# Altium schematic sheet XS1_XCORE0.SchDoc: XS1 CORE0
size A3; Date: 2011-11-28; Author: S.Choquette; Revision: 2.0; SheetNumber: 3; SheetTotal: 9
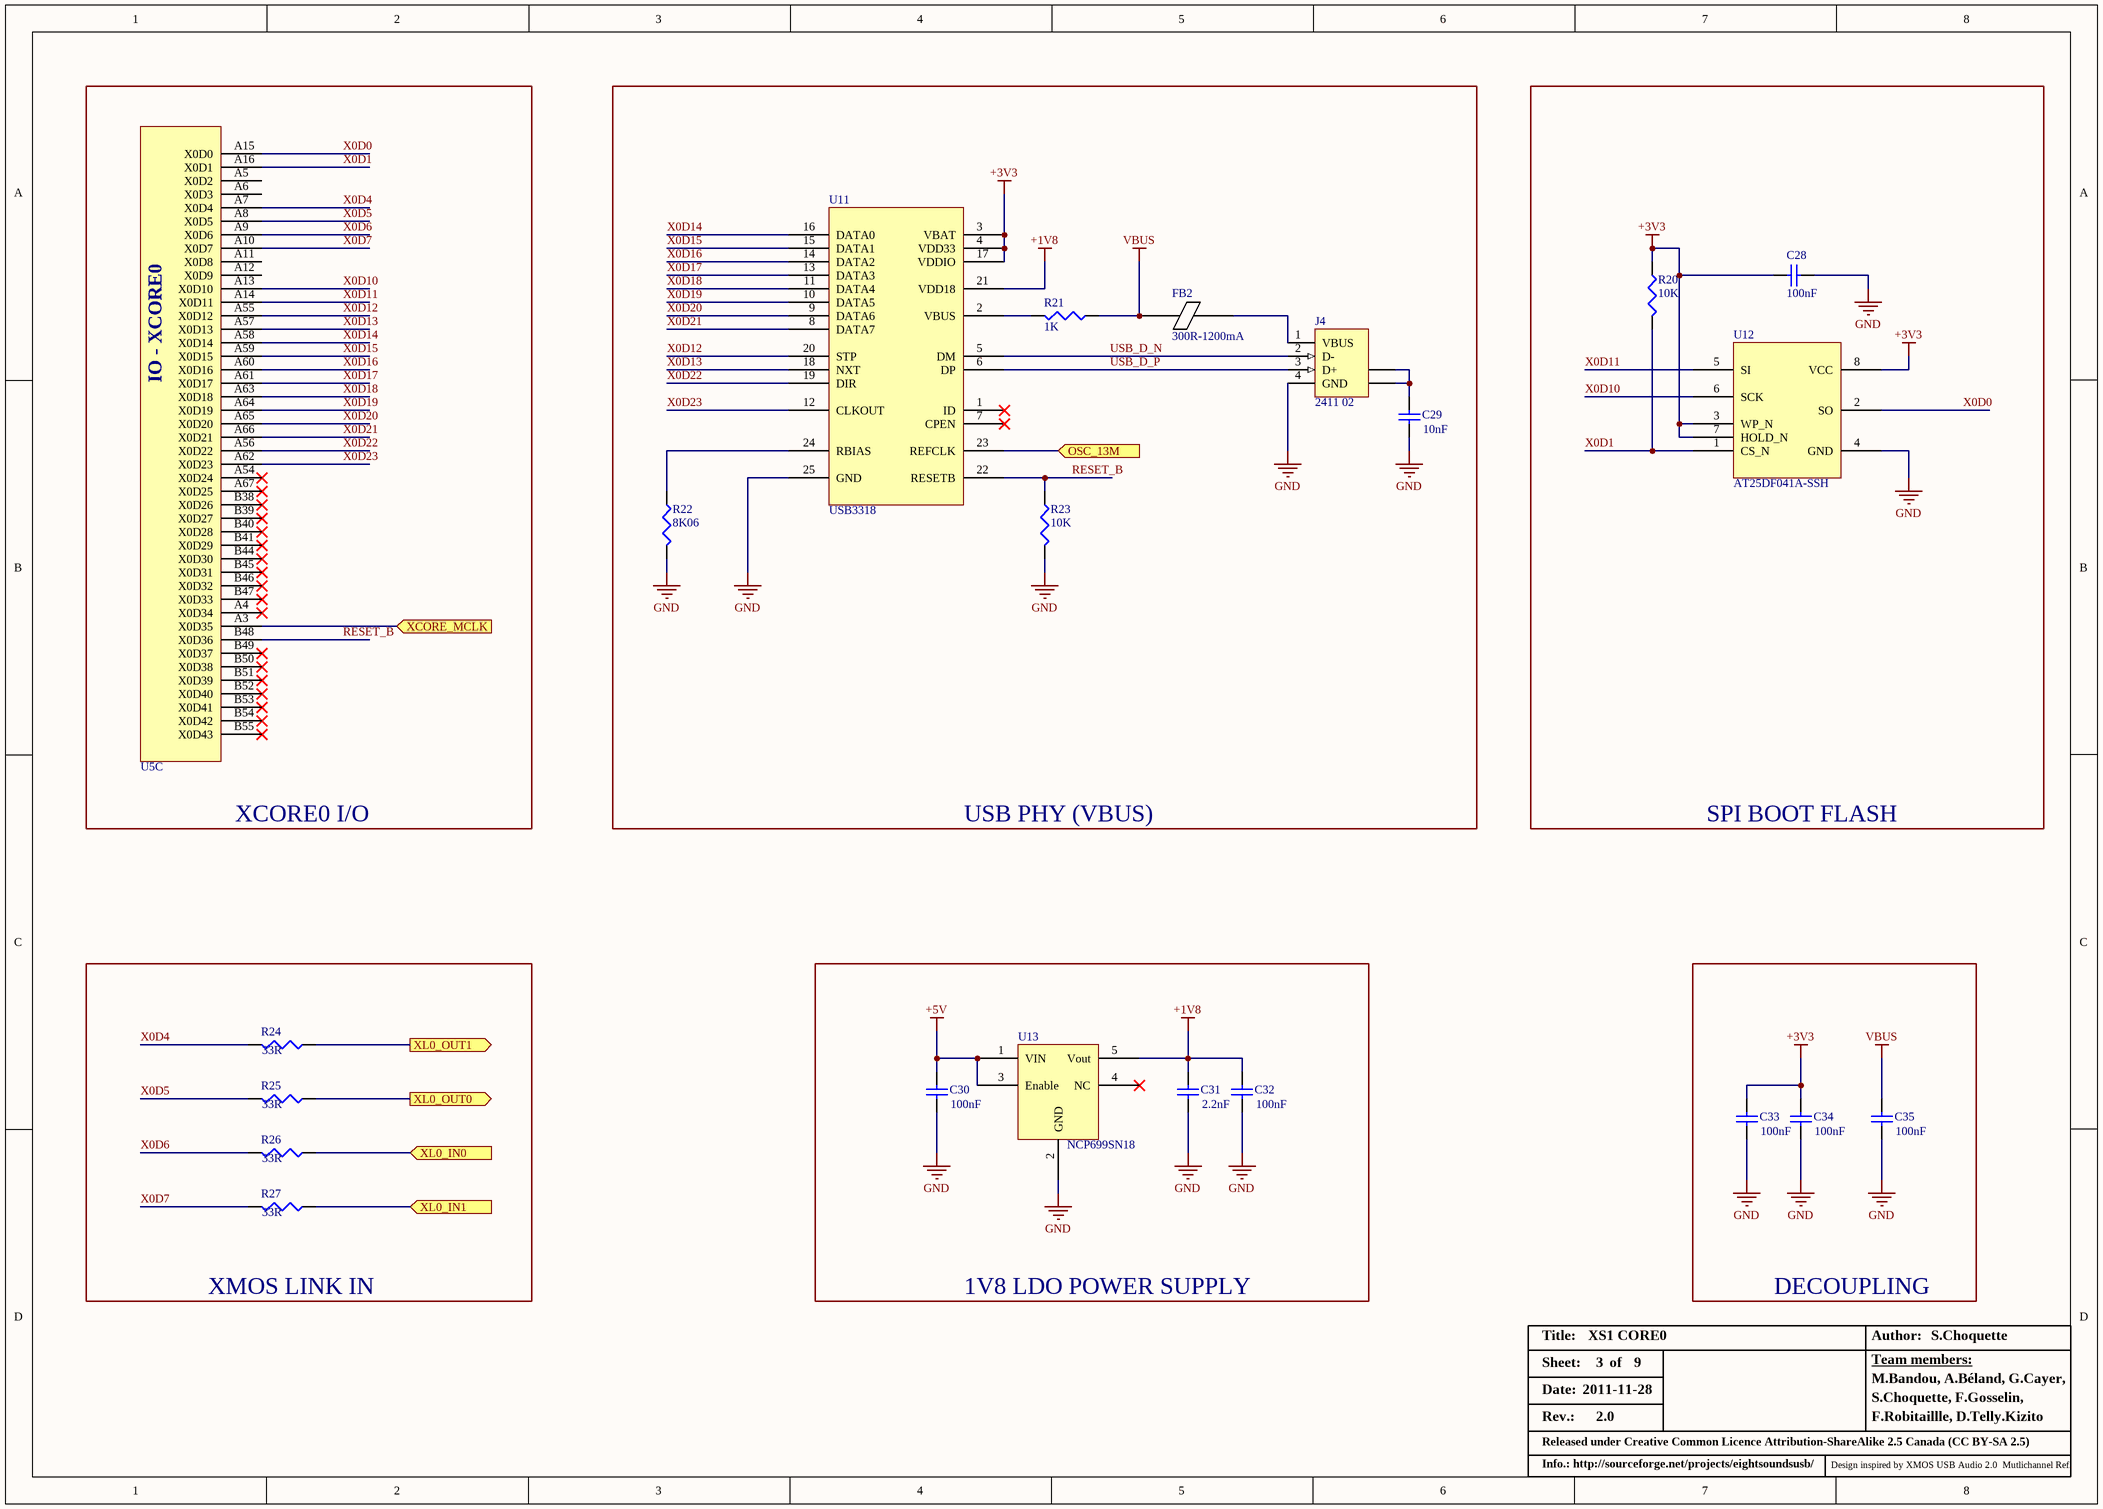
[diagram p0: XS1_XCORE0.SchDoc]

## Parts
C28  value 100nF  [3-0603]
C29  value 10nF  [3-0603]
C30  value 100nF  [3-0603]
C31  value 2.2nF  [3-0603]
C32  value 100nF  [3-0603]
C33  value 100nF  [3-0603]
C34  value 100nF  [3-0603]
C35  value 100nF  [3-0603]
FB2  300R-1200mA  [3-0603]
J4  2411 02  [787924]
R20  value 10K  [3-0603]
R21  value 1K  [3-0603]
R22  value 8K06  [3-0603]
R23  value 10K  [3-0603]
R24  value 33R  [3-0603]
R25  value 33R  [3-0603]
R26  value 33R  [3-0603]
R27  value 33R  [3-0603]
U5  XS1_L2_124QFN  [QFN-124]  (value not drawn)  (part C of 4)
U11  USB3318  [QFN50P400X400-24V9L]
U12  AT25DF041A-SSH  [8S1_L]
U13  NCP699SN18  [SOT23-5AL_MOD(1-07)]

## Blocks framed on the sheet
XCORE0 I/O: U5
USB PHY (VBUS): C29 FB2 J4 R21-R23 U11
SPI BOOT FLASH: C28 R20 U12
XMOS LINK IN: R24-R27
1V8 LDO POWER SUPPLY: C30-C32 U13
DECOUPLING: C33-C35

## Ports
OSC_13M (in), XCORE_MCLK (in), XL0_IN0 (in), XL0_IN1 (in), XL0_OUT0, XL0_OUT1

## Nets
+1V8: C31.2 C32.2 U11.21(VDD18) U13.5(Vout)
+3V3: C28.2 C33.2 C34.2 R20.1 U11.3(VBAT) U11.4(VDD33) U11.17(VDDIO) U12.3(WP_N) U12.7(HOLD_N) U12.8(VCC)
+5V: C30.2 U13.1(VIN) U13.3(Enable)
GND: C28.1 C29.1 C30.1 C31.1 C32.1 C33.1 C34.1 C35.1 J4.4(GND) R22.2 R23.2 U11.25(GND) U12.4(GND) U13.2(GND)
VBUS: C35.2 FB2.2 R21.1
OSC_13M: U11.23(REFCLK) ; port OSC_13M
RESET_B: R23.1 U5.B48(X0D36) U11.22(RESETB)
USB_D_N: J4.2(D-) U11.5(DM)
USB_D_P: J4.3(D+) U11.6(DP)
X0D0: U5.A15(X0D0) U12.2(SO)
X0D1: R20.2 U5.A16(X0D1) U12.1(CS_N)
X0D4: R24.2 U5.A7(X0D4)
X0D5: R25.2 U5.A8(X0D5)
X0D6: R26.2 U5.A9(X0D6)
X0D7: R27.2 U5.A10(X0D7)
X0D10: U5.A13(X0D10) U12.6(SCK)
X0D11: U5.A14(X0D11) U12.5(SI)
X0D12: U5.A55(X0D12) U11.20(STP)
X0D13: U5.A57(X0D13) U11.18(NXT)
X0D14: U5.A58(X0D14) U11.16(DATA0)
X0D15: U5.A59(X0D15) U11.15(DATA1)
X0D16: U5.A60(X0D16) U11.14(DATA2)
X0D17: U5.A61(X0D17) U11.13(DATA3)
X0D18: U5.A63(X0D18) U11.11(DATA4)
X0D19: U5.A64(X0D19) U11.10(DATA5)
X0D20: U5.A65(X0D20) U11.9(DATA6)
X0D21: U5.A66(X0D21) U11.8(DATA7)
X0D22: U5.A56(X0D22) U11.19(DIR)
X0D23: U5.A62(X0D23) U11.12(CLKOUT)
XCORE_MCLK: U5.A3(X0D35) ; port XCORE_MCLK
XL0_IN0: R26.1 ; port XL0_IN0
XL0_IN1: R27.1 ; port XL0_IN1
XL0_OUT0: R25.1 ; port XL0_OUT0
XL0_OUT1: R24.1 ; port XL0_OUT1
NetC29_2: C29.2 J4.5(SHLD) J4.6(SHLD)
NetFB2_1: FB2.1 J4.1(VBUS)
NetR21_2: R21.2 U11.2(VBUS)
NetR22_1: R22.1 U11.24(RBIAS)

Not connected (* = marked no-connect by the designer): U5 A4(X0D34)* A5(X0D2) A6(X0D3) A11(X0D8) A12(X0D9) A54(X0D24)* A67(X0D25)* B38(X0D26)* B39(X0D27)* B40(X0D28)* B41(X0D29)* B44(X0D30)* B45(X0D31)* B46(X0D32)* B47(X0D33)* B49(X0D37)* B50(X0D38)* B51(X0D39)* B52(X0D40)* B53(X0D41)* B54(X0D42)* B55(X0D43)*; U11 1(ID)* 7(CPEN)*; U13 4(NC)*

## Notes on the sheet
- Title:
- Date:
- Sheet:
- of
- Author:
- Team members:
- M.Bandou, A.Béland, G.Cayer,
- Rev.:
- Released under Creative Common Licence Attribution-ShareAlike 2.5 Canada (CC BY-SA 2.5)
- S.Choquette, F.Gosselin,
- F.Robitaillle, D.Telly.Kizito
- Info.: http://sourceforge.net/projects/eightsoundsusb/
- Design inspired by XMOS USB Audio 2.0  Mutlichannel Ref.
- (in symbol XS1_L2_124QFN, part C) IO - XCORE0

## Library data of the parts
C28 C30 C32-C35 = Cap: MLCC 100nF 0603 X7R 16V; Manufacturer: Murata; Part Number: GRM188R71C104KA01; Cost: 0,005
C29 = Cap: MLCC 10nF 0603 X7R 50V; Manufacturer: Murata; Part Number: GRM188R71H103KA01; Cost: 0,005
C31 = Cap: MLCC 2.2uF 0603 X5R 10V; Manufacturer: Murata; Part Number: GRM188R61A225KE34; Cost: 0,005
FB2 = 300R-1200mA: Ferrite 300R -1200mA; Part Number: BLM18SG331TN1D; Manufacturer: Murata
J4 = 787924-1: USB 2.0 connectors  Connecteurs USB 2.0; Manufacturer: Lumberg; TerminationLength: 3.02mm [0.119in.]; Part Number: 2411 02; Cost: *
R20 R23 = Res3: RES 10k 0603 1%; Manufacturer: ROHM; Part Number: MCR03EZPFX1002; Cost: *
R21 = Res3: RES 1k 0603 1%; Manufacturer: ROHM; Part Number: MCR03EZPFX1001; Cost: *
R22 = Res3: RES 8k06 0603 1%; Manufacturer: ROHM; Part Number: MCR03EZPFX8061; Cost: *
R24-R27 = Res3: RES 33R 0603 1%; Manufacturer: ROHM; Part Number: MCR03EZPFX33R0; Cost: *
U5 = XS1_L2_124QFN: Manufacturer: XMOS; Part Number: XS1-L02A-QF124-C4; Cost: *
U11 = USB3318: USB-IF 'High-Speed' compliant to USB 2.0; Manufacturer: SMSC; Part Number: USB3318; Cost: *
U12 = AT25DF041A-SSH: 4-megabit  2.3-volt or  2.7-volt  Minimum  SPI Serial Flash  Memory; Manufacturer: ATMEL; Part Number: AT25DF041A-SSH; Cost: *
U13 = NCP699SN18: 150 mA CMOS Low Iq LDO; Manufacturer: ON Semiconductor; Part Number: NCP699SN18